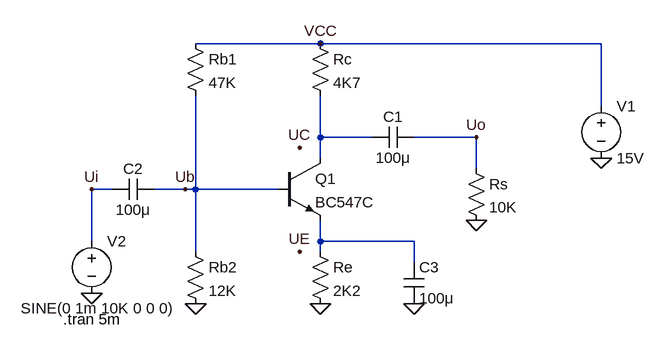
[diagram p0: schematic LAB3.asc]
LAB3.asc, the LTspice schematic file:
Version 4
SHEET 1 936 680
WIRE 432 -80 240 -80
WIRE 864 -80 432 -80
WIRE 864 16 864 -80
WIRE 432 64 432 0
WIRE 512 64 432 64
WIRE 672 64 576 64
WIRE 432 96 432 64
WIRE 672 112 672 64
WIRE 112 144 80 144
WIRE 224 144 176 144
WIRE 240 144 240 0
WIRE 240 144 224 144
WIRE 368 144 240 144
WIRE 80 224 80 144
WIRE 432 224 432 192
WIRE 576 224 432 224
WIRE 240 240 240 144
WIRE 432 240 432 224
WIRE 576 256 576 224
FLAG 80 304 0
FLAG 240 320 0
FLAG 432 320 0
FLAG 576 320 0
FLAG 672 192 0
FLAG 864 96 0
FLAG 224 144 Ub
FLAG 80 144 Ui
FLAG 400 80 UC
FLAG 400 240 UE
FLAG 432 -80 VCC
FLAG 672 64 Uo
SYMBOL npn 368 96 R0
SYMATTR InstName Q1
SYMATTR Value BC547C
SYMBOL cap 576 48 R90
WINDOW 0 0 32 VBottom 2
WINDOW 3 32 32 VTop 2
SYMATTR InstName C1
SYMATTR Value 100μ
SYMBOL res 416 224 R0
SYMATTR InstName Re
SYMATTR Value 2K2
SYMBOL res 416 -96 R0
SYMATTR InstName Rc
SYMATTR Value 4K7
SYMBOL res 224 -96 R0
SYMATTR InstName Rb1
SYMATTR Value 47K
SYMBOL res 224 224 R0
SYMATTR InstName Rb2
SYMATTR Value 12K
SYMBOL res 656 96 R0
SYMATTR InstName Rs
SYMATTR Value 10K
SYMBOL voltage 864 0 R0
WINDOW 123 0 0 Left 0
WINDOW 39 0 0 Left 0
SYMATTR InstName V1
SYMATTR Value 15V
SYMBOL voltage 80 208 R0
WINDOW 3 -109 119 Left 2
WINDOW 123 0 0 Left 0
WINDOW 39 0 0 Left 0
SYMATTR InstName V2
SYMATTR Value SINE(0 1m 10K 0 0 0)
SYMBOL cap 176 128 R90
WINDOW 0 0 32 VBottom 2
WINDOW 3 32 32 VTop 2
SYMATTR InstName C2
SYMATTR Value 100μ
SYMBOL cap 560 256 R0
SYMATTR InstName C3
SYMATTR Value 100μ
TEXT 36 344 Left 2 !.tran 5m

The netlist it stands for:
* LAB3.asc
Q1 N001 Ub N002 0 BC547C
C1 Uo N001 100μ
Re N002 0 2K2
Rc VCC N001 4K7
Rb1 VCC Ub 47K
Rb2 Ub 0 12K
Rs Uo 0 10K
V1 VCC 0 15V
V2 Ui 0 SINE(0 1m 10K 0 0 0)
C2 Ub Ui 100μ
C3 N002 0 100μ
.model NPN NPN
.model PNP PNP
.lib standard.bjt
.tran 5m
.backanno
.end